# Altium schematic sheet jeu_du_moulin_boura_TouchPAD_SCH.SchDoc
size A3; Organization: Ecole des Métiers de Fribourg; Address1: Ch. du Musée 2; Address2: 1700 Fribourg; Address3: Switzerland; DocumentNumber: 2; SheetNumber: 2; SheetTotal: 3; BraceOpen: [; BraceClose: ]; Point: .
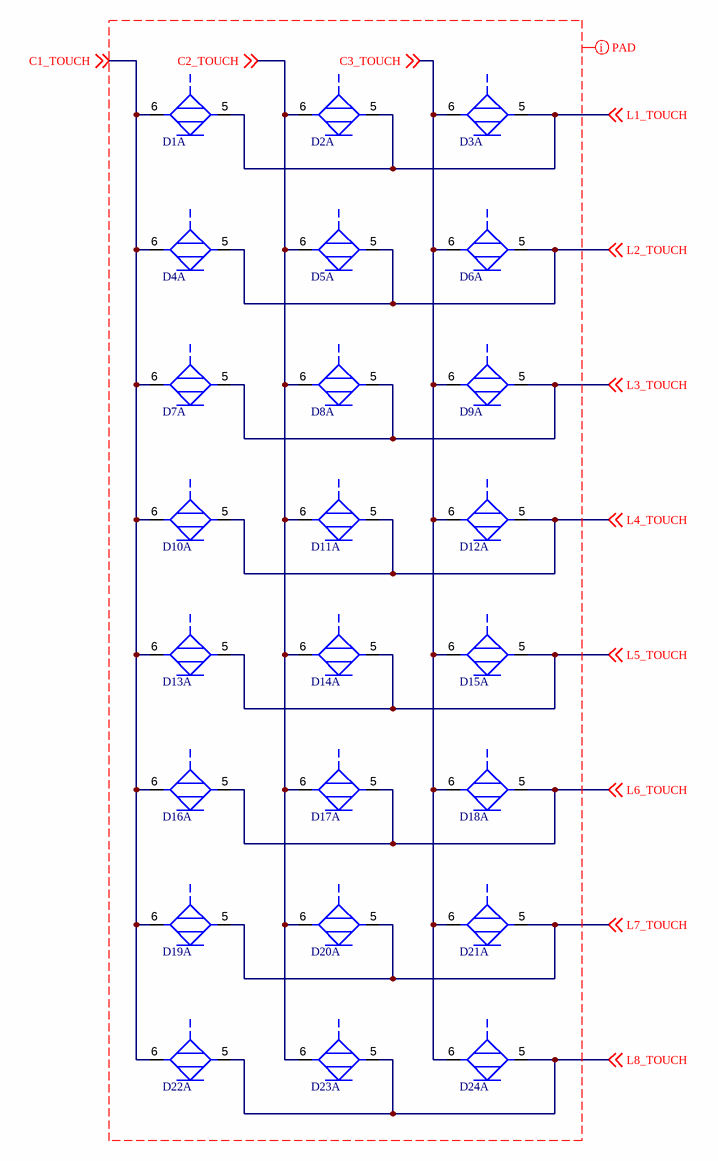
[diagram p0: jeu_du_moulin_boura_TouchPAD_SCH.SchDoc]

## Parts
D1  AAA3528SURKCGKC09  [TouchPAD-8mm+LED 4-SMD CIR]  (value not drawn)  (part A of 3)
D2  AAA3528SURKCGKC09  [TouchPAD-8mm+LED 4-SMD CIR]  (value not drawn)  (part A of 3)
D3  AAA3528SURKCGKC09  [TouchPAD-8mm+LED 4-SMD CIR]  (value not drawn)  (part A of 3)
D4  AAA3528SURKCGKC09  [TouchPAD-8mm+LED 4-SMD CIR]  (value not drawn)  (part A of 3)
D5  AAA3528SURKCGKC09  [TouchPAD-8mm+LED 4-SMD CIR]  (value not drawn)  (part A of 3)
D6  AAA3528SURKCGKC09  [TouchPAD-8mm+LED 4-SMD CIR]  (value not drawn)  (part A of 3)
D7  AAA3528SURKCGKC09  [TouchPAD-8mm+LED 4-SMD CIR]  (value not drawn)  (part A of 3)
D8  AAA3528SURKCGKC09  [TouchPAD-8mm+LED 4-SMD CIR]  (value not drawn)  (part A of 3)
D9  AAA3528SURKCGKC09  [TouchPAD-8mm+LED 4-SMD CIR]  (value not drawn)  (part A of 3)
D10  AAA3528SURKCGKC09  [TouchPAD-8mm+LED 4-SMD CIR]  (value not drawn)  (part A of 3)
D11  AAA3528SURKCGKC09  [TouchPAD-8mm+LED 4-SMD CIR]  (value not drawn)  (part A of 3)
D12  AAA3528SURKCGKC09  [TouchPAD-8mm+LED 4-SMD CIR]  (value not drawn)  (part A of 3)
D13  AAA3528SURKCGKC09  [TouchPAD-8mm+LED 4-SMD CIR]  (value not drawn)  (part A of 3)
D14  AAA3528SURKCGKC09  [TouchPAD-8mm+LED 4-SMD CIR]  (value not drawn)  (part A of 3)
D15  AAA3528SURKCGKC09  [TouchPAD-8mm+LED 4-SMD CIR]  (value not drawn)  (part A of 3)
D16  AAA3528SURKCGKC09  [TouchPAD-8mm+LED 4-SMD CIR]  (value not drawn)  (part A of 3)
D17  AAA3528SURKCGKC09  [TouchPAD-8mm+LED 4-SMD CIR]  (value not drawn)  (part A of 3)
D18  AAA3528SURKCGKC09  [TouchPAD-8mm+LED 4-SMD CIR]  (value not drawn)  (part A of 3)
D19  AAA3528SURKCGKC09  [TouchPAD-8mm+LED 4-SMD CIR]  (value not drawn)  (part A of 3)
D20  AAA3528SURKCGKC09  [TouchPAD-8mm+LED 4-SMD CIR]  (value not drawn)  (part A of 3)
D21  AAA3528SURKCGKC09  [TouchPAD-8mm+LED 4-SMD CIR]  (value not drawn)  (part A of 3)
D22  AAA3528SURKCGKC09  [TouchPAD-8mm+LED 4-SMD CIR]  (value not drawn)  (part A of 3)
D23  AAA3528SURKCGKC09  [TouchPAD-8mm+LED 4-SMD CIR]  (value not drawn)  (part A of 3)
D24  AAA3528SURKCGKC09  [TouchPAD-8mm+LED 4-SMD CIR]  (value not drawn)  (part A of 3)

## Nets
C1_TOUCH: D1.6(TPAD) D4.6(TPAD) D7.6(TPAD) D10.6(TPAD) D13.6(TPAD) D16.6(TPAD) D19.6(TPAD) D22.6(TPAD) ; off-sheet C1_TOUCH
C2_TOUCH: D2.6(TPAD) D5.6(TPAD) D8.6(TPAD) D11.6(TPAD) D14.6(TPAD) D17.6(TPAD) D20.6(TPAD) D23.6(TPAD) ; off-sheet C2_TOUCH
C3_TOUCH: D3.6(TPAD) D6.6(TPAD) D9.6(TPAD) D12.6(TPAD) D15.6(TPAD) D18.6(TPAD) D21.6(TPAD) D24.6(TPAD) ; off-sheet C3_TOUCH
L1_TOUCH: D1.5(TPAD) D2.5(TPAD) D3.5(TPAD) ; off-sheet L1_TOUCH
L2_TOUCH: D4.5(TPAD) D5.5(TPAD) D6.5(TPAD) ; off-sheet L2_TOUCH
L3_TOUCH: D7.5(TPAD) D8.5(TPAD) D9.5(TPAD) ; off-sheet L3_TOUCH
L4_TOUCH: D10.5(TPAD) D11.5(TPAD) D12.5(TPAD) ; off-sheet L4_TOUCH
L5_TOUCH: D13.5(TPAD) D14.5(TPAD) D15.5(TPAD) ; off-sheet L5_TOUCH
L6_TOUCH: D16.5(TPAD) D17.5(TPAD) D18.5(TPAD) ; off-sheet L6_TOUCH
L7_TOUCH: D19.5(TPAD) D20.5(TPAD) D21.5(TPAD) ; off-sheet L7_TOUCH
L8_TOUCH: D22.5(TPAD) D23.5(TPAD) D24.5(TPAD) ; off-sheet L8_TOUCH

## Layout directives
rule Width Constraint [Pref Width = 0.8mm    Min Width = 0.2mm    Max Width = 0.8mm]: C1_TOUCH, C2_TOUCH, C3_TOUCH

## Notes on the sheet
- SECTION ELECTRONIQUE
- CH-1700 FRIBORURG
- SWITZERLAND
- ECOLE DES METIERS DE FRIBOURG
- Drawn by:
- Date:
- Checked by:
- Release:
- P/N:
- REV:
- Sheet
- of
- This drawing is confidential and may not be divulged in whole or in part to a third party

## Library data of the parts
D1-D24 = TouchPAD-BILED4SMD